# EAGLE design Mixer (EAGLE 9.0.0)
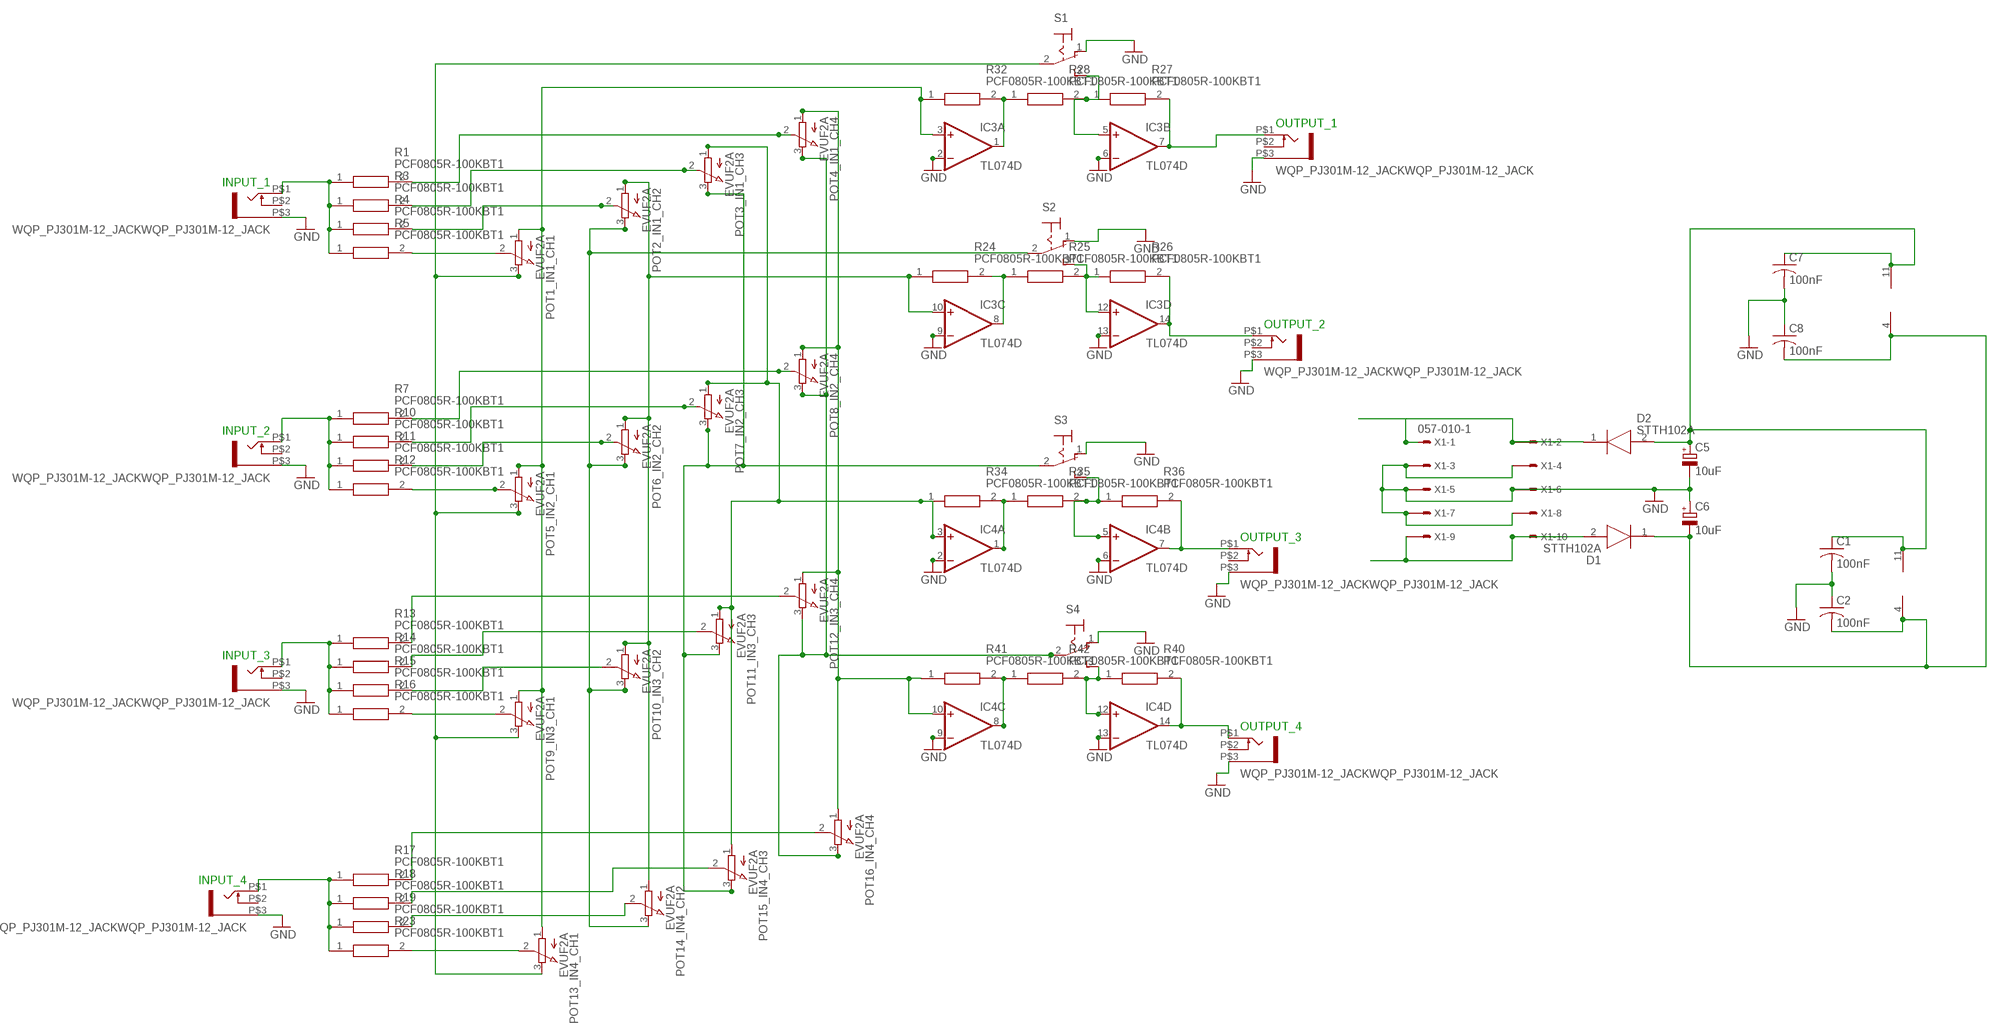
[diagram p0: schematic, sheet 1]

## Parts
C1  100nF  C-USC0805K  [C0805K]
C2  100nF  C-USC0805K  [C0805K]
C5  10uF  CPOL-EU153CLV-0605  [153CLV-0605]
C6  10uF  CPOL-EU153CLV-0605  [153CLV-0605]
C7  100nF  C-USC0805K  [C0805K]
C8  100nF  C-USC0805K  [C0805K]
D1  STTH102A  [DIOM5126X265N]
D2  STTH102A  [DIOM5126X265N]
IC3  TL074D  [SO14]
IC4  TL074D  [SO14]
INPUT_1  WQP_PJ301M-12_JACKWQP_PJ301M-12_JACK  [JACK-3.5]
INPUT_2  WQP_PJ301M-12_JACKWQP_PJ301M-12_JACK  [JACK-3.5]
INPUT_3  WQP_PJ301M-12_JACKWQP_PJ301M-12_JACK  [JACK-3.5]
INPUT_4  WQP_PJ301M-12_JACKWQP_PJ301M-12_JACK  [JACK-3.5]
OUTPUT_1  WQP_PJ301M-12_JACKWQP_PJ301M-12_JACK  [JACK-3.5]
OUTPUT_2  WQP_PJ301M-12_JACKWQP_PJ301M-12_JACK  [JACK-3.5]
OUTPUT_3  WQP_PJ301M-12_JACKWQP_PJ301M-12_JACK  [JACK-3.5]
OUTPUT_4  WQP_PJ301M-12_JACKWQP_PJ301M-12_JACK  [JACK-3.5]
POT1_IN1_CH1  EVUF2A  [EVUF]
POT2_IN1_CH2  EVUF2A  [EVUF]
POT3_IN1_CH3  EVUF2A  [EVUF]
POT4_IN1_CH4  EVUF2A  [EVUF]
POT5_IN2_CH1  EVUF2A  [EVUF]
POT6_IN2_CH2  EVUF2A  [EVUF]
POT7_IN2_CH3  EVUF2A  [EVUF]
POT8_IN2_CH4  EVUF2A  [EVUF]
POT9_IN3_CH1  EVUF2A  [EVUF]
POT10_IN3_CH2  EVUF2A  [EVUF]
POT11_IN3_CH3  EVUF2A  [EVUF]
POT12_IN3_CH4  EVUF2A  [EVUF]
POT13_IN4_CH1  EVUF2A  [EVUF]
POT14_IN4_CH2  EVUF2A  [EVUF]
POT15_IN4_CH3  EVUF2A  [EVUF]
POT16_IN4_CH4  EVUF2A  [EVUF]
R1  PCF0805R-100KBT1  [RESC2012X65N]
R3  PCF0805R-100KBT1  [RESC2012X65N]
R4  PCF0805R-100KBT1  [RESC2012X65N]
R5  PCF0805R-100KBT1  [RESC2012X65N]
R7  PCF0805R-100KBT1  [RESC2012X65N]
R10  PCF0805R-100KBT1  [RESC2012X65N]
R11  PCF0805R-100KBT1  [RESC2012X65N]
R12  PCF0805R-100KBT1  [RESC2012X65N]
R13  PCF0805R-100KBT1  [RESC2012X65N]
R14  PCF0805R-100KBT1  [RESC2012X65N]
R15  PCF0805R-100KBT1  [RESC2012X65N]
R16  PCF0805R-100KBT1  [RESC2012X65N]
R17  PCF0805R-100KBT1  [RESC2012X65N]
R18  PCF0805R-100KBT1  [RESC2012X65N]
R19  PCF0805R-100KBT1  [RESC2012X65N]
R23  PCF0805R-100KBT1  [RESC2012X65N]
R24  PCF0805R-100KBT1  [RESC2012X65N]
R25  PCF0805R-100KBT1  [RESC2012X65N]
R26  PCF0805R-100KBT1  [RESC2012X65N]
R27  PCF0805R-100KBT1  [RESC2012X65N]
R28  PCF0805R-100KBT1  [RESC2012X65N]
R32  PCF0805R-100KBT1  [RESC2012X65N]
R34  PCF0805R-100KBT1  [RESC2012X65N]
R35  PCF0805R-100KBT1  [RESC2012X65N]
R36  PCF0805R-100KBT1  [RESC2012X65N]
R40  PCF0805R-100KBT1  [RESC2012X65N]
R41  PCF0805R-100KBT1  [RESC2012X65N]
R42  PCF0805R-100KBT1  [RESC2012X65N]
S1  M9040P  [M9040P]
S2  M9040P  [M9040P]
S3  M9040P  [M9040P]
S4  M9040P  [M9040P]
X1  057-010-1  [057-010-1]

## Nets
GND: C1.2 C2.1 C5.- C6.+ C7.2 C8.1 IC3.2(A:-IN) IC3.6(B:-IN) IC3.9(C:-IN) IC3.13(D:-IN) IC4.2(A:-IN) IC4.6(B:-IN) IC4.9(C:-IN) IC4.13(D:-IN) INPUT_1.P$3 INPUT_2.P$3 INPUT_3.P$3 INPUT_4.P$3 OUTPUT_1.P$3 OUTPUT_2.P$3 OUTPUT_3.P$3 OUTPUT_4.P$3 S1.1(O) S2.1(O) S3.1(O) S4.1(O) X1.3 X1.4 X1.5 X1.6 X1.7 X1.8
N$1: INPUT_2.P$1 R7.1 R10.1 R11.1 R12.1
N$2: POT13_IN4_CH1.2(S) R23.2
N$3: POT14_IN4_CH2.2(S) R19.2
N$4: POT15_IN4_CH3.2(S) R18.2
N$5: POT16_IN4_CH4.2(S) R17.2
N$6: IC3.1(A:OUT) R28.1 R32.2
N$7: IC3.10(C:+IN) POT2_IN1_CH2.1(A) POT6_IN2_CH2.1(A) POT10_IN3_CH2.1(A) POT14_IN4_CH2.1(A) R24.1
N$8: IC4.14(D:OUT) OUTPUT_4.P$1 R40.2
N$9: POT5_IN2_CH1.2(S) R12.2
N$10: POT6_IN2_CH2.2(S) R11.2
N$11: POT7_IN2_CH3.2(S) R10.2
N$12: POT8_IN2_CH4.2(S) R7.2
N$13: IC3.8(C:OUT) R24.2 R25.1
N$14: IC4.1(A:OUT) R34.2 R35.1
N$15: D1.2(A) X1.9 X1.10
N$16: C1.1 C5.+ C7.1 D2.2(A) IC3.11(P:V-) IC4.11(P:V-)
N$17: POT1_IN1_CH1.2(S) R5.2
N$18: POT2_IN1_CH2.2(S) R4.2
N$19: POT2_IN1_CH2.3(E) POT6_IN2_CH2.3(E) POT10_IN3_CH2.3(E) POT14_IN4_CH2.3(E) S2.2(P)
N$20: IC3.12(D:+IN) R25.2 R26.1 S2.3(S)
N$21: POT1_IN1_CH1.3(E) POT5_IN2_CH1.3(E) POT9_IN3_CH1.3(E) POT13_IN4_CH1.3(E) S1.2(P)
N$22: IC3.3(A:+IN) POT1_IN1_CH1.1(A) POT5_IN2_CH1.1(A) POT9_IN3_CH1.1(A) POT13_IN4_CH1.1(A) R32.1
N$23: IC3.5(B:+IN) R27.1 R28.2 S1.3(S)
N$24: IC3.7(B:OUT) OUTPUT_1.P$1 R27.2
N$25: IC3.14(D:OUT) OUTPUT_2.P$1 R26.2
N$26: D2.1(K) X1.1 X1.2
N$27: IC4.12(D:+IN) R40.1 R42.2 S4.3(S)
N$28: POT3_IN1_CH3.3(E) POT7_IN2_CH3.3(E) POT11_IN3_CH3.3(E) POT15_IN4_CH3.3(E) S3.2(P)
N$29: IC4.3(A:+IN) POT3_IN1_CH3.1(A) POT7_IN2_CH3.1(A) POT11_IN3_CH3.1(A) POT15_IN4_CH3.1(A) R34.1
N$30: IC4.5(B:+IN) R35.2 R36.1 S3.3(S)
N$31: IC4.7(B:OUT) OUTPUT_3.P$1 R36.2
N$32: INPUT_1.P$1 R1.1 R3.1 R4.1 R5.1
N$33: POT3_IN1_CH3.2(S) R3.2
N$34: POT4_IN1_CH4.2(S) R1.2
N$35: C2.2 C6.- C8.2 D1.1(K) IC3.4(P:V+) IC4.4(P:V+)
N$36: POT9_IN3_CH1.2(S) R16.2
N$37: POT10_IN3_CH2.2(S) R15.2
N$38: POT11_IN3_CH3.2(S) R14.2
N$39: POT12_IN3_CH4.2(S) R13.2
N$40: IC4.10(C:+IN) POT4_IN1_CH4.1(A) POT8_IN2_CH4.1(A) POT12_IN3_CH4.1(A) POT16_IN4_CH4.1(A) R41.1
N$41: IC4.8(C:OUT) R41.2 R42.1
N$43: INPUT_3.P$1 R13.1 R14.1 R15.1 R16.1
N$44: INPUT_4.P$1 R17.1 R18.1 R19.1 R23.1
N$45: POT4_IN1_CH4.3(E) POT8_IN2_CH4.3(E) POT12_IN3_CH4.3(E) POT16_IN4_CH4.3(E) S4.2(P)
Unconnected: INPUT_1.P$2 INPUT_2.P$2 INPUT_3.P$2 INPUT_4.P$2 OUTPUT_1.P$2 OUTPUT_2.P$2 OUTPUT_3.P$2 OUTPUT_4.P$2

## Library data of the parts
C1 C2 C7 C8 = resistor:C-US: CAPACITOR, American symbol
C5 C6 = rcl:CPOL-EU: POLARIZED CAPACITOR, European symbol; SPICEPREFIX: C
D1 D2 = STTH102A:STTH102A: HE rectifier diode,STTH102A 1A 200V SMA STMicroelectronics STTH102A, SMT Switching Diode, 200V 1A, 20ns, 2-Pin DO-214AC Source: Datasheet <https://www.arrow.com/en/products/stth102a/stmicroelectronics>; ARROW_PART_NUMBER: STTH102A; DESCRIPTION: HE rectifier diode,STTH102A 1A 200V SMA STMicroelectronics STTH102A, SMT Switching Diode, 200V 1A, 20ns, 2-Pin DO-214AC; HEIGHT: 2.65mm; MANUFACTURER_NAME: STMicroelectronics; MANUFACTURER_PART_NUMBER: STTH102A
IC3 IC4 = linear:TL074: OP AMP
INPUT_1-INPUT_4 OUTPUT_1-OUTPUT_4 = thonkiconn_eagle_v5 (2):WQP_PJ301M-12_JACK: 3.5mm Vertical Jack from Thonk.co.uk
POT1_IN1_CH1 POT2_IN1_CH2 POT3_IN1_CH3 POT4_IN1_CH4 POT5_IN2_CH1 POT6_IN2_CH2 POT7_IN2_CH3 POT8_IN2_CH4 POT9_IN3_CH1 POT10_IN3_CH2 POT11_IN3_CH3 POT12_IN3_CH4 POT13_IN4_CH1 POT14_IN4_CH2 POT15_IN4_CH3 POT16_IN4_CH4 = pot:EVU: 9 mm Square Rotary Potentiometers Source: Panasonic
R1 R3-R5 R7 R10-R19 R23-R28 R32 R34-R36 R40-R42 = PCF0805R-100KBT1:PCF0805R-100KBT1: WELWYN - PCF0805R-100KBT1 - RES, THIN FILM, 100K, 0.1%, 0.1W, 0805 Source: Datasheet <https://componentsearchengine.com/Datasheets/1/PCF0805-13-10KBT1.pdf>; ARROW_PART_NUMBER: PCF0805R-100KBT1; DESCRIPTION: WELWYN - PCF0805R-100KBT1 - RES, THIN FILM, 100K, 0.1%, 0.1W, 0805; HEIGHT: 0.65mm; MANUFACTURER_NAME: WELWYN; MANUFACTURER_PART_NUMBER: PCF0805R-100KBT1
S1-S4 = switch:M9040P: TOGGLE SWITCH Marquardt
X1 = con-panduit:057-010-: CONNECTOR 10-pin series 057 contact pc board low profile headers; OC_FARNELL: unknown; OC_NEWARK: unknown

## Board
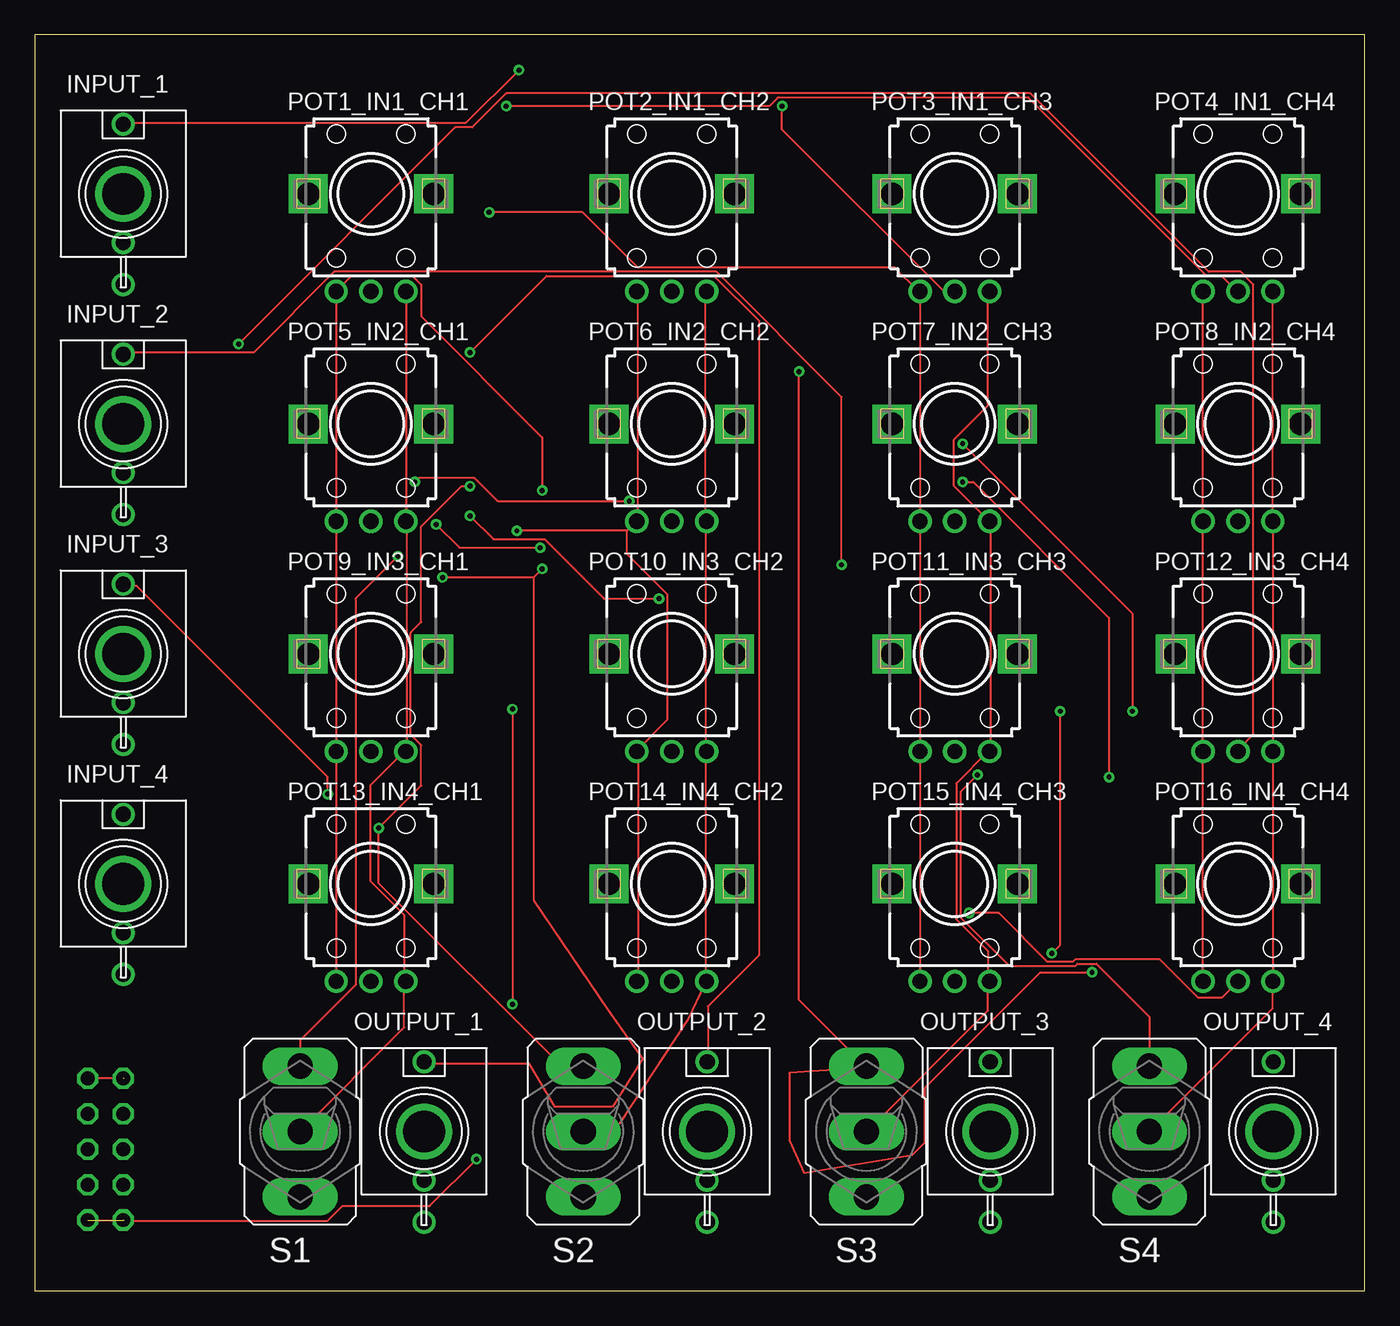
[diagram p1: board, top side]
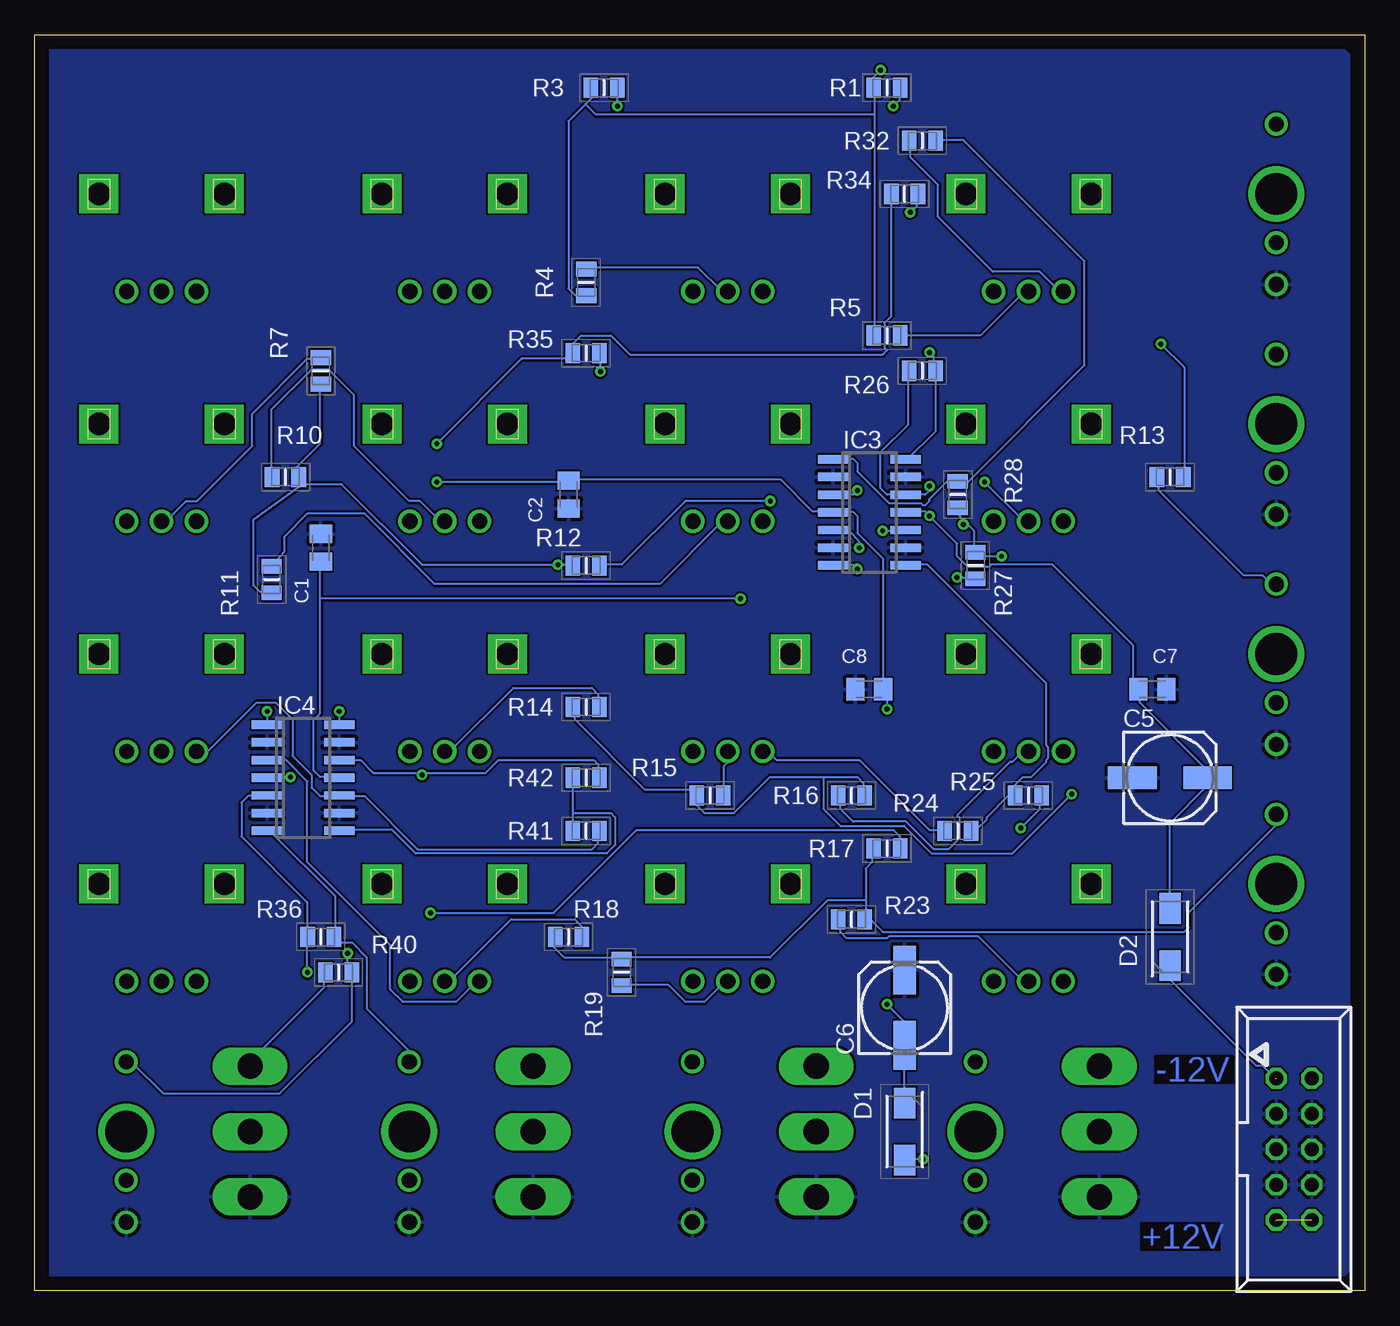
[diagram p2: board, bottom side, seen from below]

Size 95.46 x 90.16 mm. Coordinates in mm from the lower left corner, seen from the top.
Outline: 0,0 95.46,0 95.46,90.16 0,90.16 0,0
Copper layers (1*16): Top 0.035mm / dielectric 1.5mm / Bottom 0.035mm
Design rules "default": minimum track width 6mil, minimum drill 0.35mm, track to track 6mil, track to pad 6mil, pad to pad 6mil, via to via 6mil, smd to smd 6mil, copper to edge 40mil, drill to drill 6mil, minimum pad ring 10mil, minimum via ring 8mil, stop-mask expansion 4mil, vias tented up to drill 0mil, thermal gap 10mil

### Footprints (pad centres in the part's own frame; a part is rotated, then mirrored left to right if it is on the bottom)
C0805K = smd 1.3 x 1.6: 1 -1,0; 2 1,0
153CLV-0605 = smd 3.5 x 1.6: + 2.7,0; - -2.7,0
DIOM5126X265N = smd 2.2 x 1.55: 1 -2.05,0; 2 2.05,0
SO14 = smd 0.6 x 2.2: 1 -3.81,-2.6; 2 -2.54,-2.6; 3 -1.27,-2.6; 4 0,-2.6; 5 1.27,-2.6; 6 2.54,-2.6; 7 3.81,-2.6; 8 3.81,2.6; 9 2.54,2.6; 10 1.27,2.6; 11 0,2.6; 12 -1.27,2.6; 13 -2.54,2.6; 14 -3.81,2.6
JACK-3.5 = drill 1.1: P$1 0,5; P$2 0,-3.5; P$3 0,-6.5 | drill 3: P$4 0,0
EVUF = drill 1.1 pad 1.676: 1 -2.5,-7; 2 0,-7; 3 2.5,-7 | drill 1.6 pad 2.8 square: M1 4.5,0; M2 -4.5,0
RESC2012X65N = smd 1.05 x 1.45: 1 -0.95,0; 2 0.95,0
M9040P = drill 1.803 long: 1 0,4.699; 2 0,0; 3 0,-4.699
057-010-1 = drill 1 octagon: 1 -5.08,-1.27; 2 -5.08,1.27; 3 -2.54,-1.27; 4 -2.54,1.27; 5 0,-1.27; 6 0,1.27; 7 2.54,-1.27; 8 2.54,1.27; 9 5.08,-1.27; 10 5.08,1.27

### Placement (x,y rotation side)
C1  74.93,53.34 90 bottom
C2  57.15,57.15 90 bottom
C5  13.97,36.83 0 bottom
C6  33.02,20.32 90 bottom
C7  15.24,43.18 0 bottom
C8  35.56,43.18 0 bottom
D1  33.02,11.43 270 bottom
D2  13.97,25.4 90 bottom
IC3  35.56,55.88 270 bottom
IC4  76.2,36.83 270 bottom
INPUT_1  6.35,78.74 0 top
INPUT_2  6.35,62.23 0 top
INPUT_3  6.35,45.72 0 top
INPUT_4  6.35,29.21 0 top
OUTPUT_1  27.94,11.43 0 top
OUTPUT_2  48.26,11.43 0 top
OUTPUT_3  68.58,11.43 0 top
OUTPUT_4  88.9,11.43 0 top
POT1_IN1_CH1  24.13,78.74 0 top
POT2_IN1_CH2  45.72,78.74 0 top
POT3_IN1_CH3  66.04,78.74 0 top
POT4_IN1_CH4  86.36,78.74 0 top
POT5_IN2_CH1  24.13,62.23 0 top
POT6_IN2_CH2  45.72,62.23 0 top
POT7_IN2_CH3  66.04,62.23 0 top
POT8_IN2_CH4  86.36,62.23 0 top
POT9_IN3_CH1  24.13,45.72 0 top
POT10_IN3_CH2  45.72,45.72 0 top
POT11_IN3_CH3  66.04,45.72 0 top
POT12_IN3_CH4  86.36,45.72 0 top
POT13_IN4_CH1  24.13,29.21 0 top
POT14_IN4_CH2  45.72,29.21 0 top
POT15_IN4_CH3  66.04,29.21 0 top
POT16_IN4_CH4  86.36,29.21 0 top
R1  34.29,86.36 0 bottom
R3  54.61,86.36 0 bottom
R4  55.88,72.39 90 bottom
R5  34.29,68.58 0 bottom
R7  74.93,66.04 90 bottom
R10  77.47,58.42 180 bottom
R11  78.47,51.07 90 bottom
R12  55.88,52.07 0 bottom
R13  13.97,58.42 0 bottom
R14  55.88,41.91 0 bottom
R15  46.99,35.56 0 bottom
R16  36.83,35.56 180 bottom
R17  34.29,31.75 0 bottom
R18  57.15,25.4 0 bottom
R19  53.34,22.86 270 bottom
R23  36.83,26.67 180 bottom
R24  29.21,33.02 0 bottom
R25  24.13,35.56 0 bottom
R26  31.75,66.04 0 bottom
R27  27.94,52.07 270 bottom
R28  29.21,57.15 270 bottom
R32  31.75,82.55 0 bottom
R34  33.02,78.74 180 bottom
R35  55.88,67.31 0 bottom
R36  74.93,25.4 0 bottom
R40  73.66,22.86 0 bottom
R41  55.88,33.02 180 bottom
R42  55.88,36.83 0 bottom
S1  19.05,11.43 180 top
S2  39.37,11.43 180 top
S3  59.69,11.43 180 top
S4  80.01,11.43 180 top
X1  5.08,10.16 270 bottom

### Tracks (layer width: path | path; a pad name or v marks a point on that pad's centre or on a via)
+12V  (via drill 0.35)
  Top 0.152: v6.25,5.03 v3.81,5.03
GND
  pour Bottom: 0,87.63 2.54,90.17 93.98,90.17 96.52,87.63 96.52,2.54 93.98,0 2.54,0 0,2.54
N$1  (via drill 0.35)
  Top 0.152: v57.91,52.12 57.91,64.16 48.92,73.15 21.49,73.15 15.7,67.36 6.4,67.36 INPUT_2.P$1
  Bottom 0.152: 76.05,57.91 73.46,57.91 67.67,52.12 v57.91,52.12 56.84,52.12 R12.1 | 76.05,57.91 76.5,58.37 R10.1 | R7.1 74.98,65.08 74.98,60.81 76.66,59.13 76.66,58.52 R10.1 | 76.05,57.91 76.2,57.91 79.79,55.32 79.79,50.66 79.33,50.21 78.57,50.21 R11.1 | 76.05,57.91 R10.1
N$2
  Bottom 0.152: R23.2 37.64,26.67 37.64,25.76 37.19,25.3 34.29,25.3 34.14,25.45 27.74,25.45 24.54,22.25 24.23,22.25 POT13_IN4_CH1.2
N$3
  Bottom 0.152: R19.2 53.34,21.95 49.99,21.95 48.77,20.73 47.4,20.73 46.02,22.1 45.72,22.1 POT14_IN4_CH2.2
N$4
  Bottom 0.152: R18.2 56.24,25.45 56.24,26.21 56.69,26.67 61.27,26.67 65.68,22.25 65.99,22.25 POT15_IN4_CH3.2
N$5  (via drill 0.35)
  Top 0.152: v67.06,27.13 69.19,27.13 72.69,23.62 74.52,23.62 74.68,23.77 80.77,23.77 83.52,21.03 85.19,21.03 86.26,22.1 POT16_IN4_CH4.2
  Bottom 0.152: v67.06,27.13 58.22,27.13 52.27,33.07 33.83,33.07 33.38,32.61 33.38,31.85 R17.2
N$6
  Bottom 0.152: IC3.1 38.1,59.74 36.73,59.74 36.42,59.44 36.42,58.83 34.14,56.54 31.85,56.54 31.7,56.39 31.55,56.39 31.24,56.69 31.24,56.84 30.02,58.06 29.26,58.06 R28.1 29.11,58.06 28.5,58.06 20.12,66.45 20.12,73.91 28.8,82.6 30.79,82.6 R32.2
N$7  (via drill 0.35)
  Top 0.152: 42.52,54.56 v34.59,54.56 | 42.52,54.56 43.13,55.17 POT6_IN2_CH2.1 43.28,55.32 43.28,71.63 POT2_IN1_CH2.1 | POT14_IN4_CH2.1 43.28,22.25 43.28,38.71 POT10_IN3_CH2.1 43.28,38.86 45.41,41 45.41,49.99 42.52,52.88 42.52,54.56
  Bottom 0.152: v34.59,54.56 33.07,54.56 IC3.10 | R24.1 30.18,33.07 31.24,33.07 36.27,38.1 42.22,38.1 42.82,38.71 43.13,38.71 POT10_IN3_CH2.1
N$8  (via drill 0.35)
  Top 0.152: v73.61,41.6 73.61,24.84 v73,24.23
  Bottom 0.152: OUTPUT_4.P$1 88.85,16.31 88.39,16.31 86.26,14.17 77.88,14.17 72.69,19.36 72.69,22.86 R40.2 72.85,22.86 73,23.01 v73,24.23 | v73.61,41.6 73.61,40.69 IC4.14
N$9  (via drill 0.35)
  Top 0.152: v42.67,56.69 33.22,56.69 31.55,58.37 27.58,58.37 v27.28,58.06
  Bottom 0.152: v42.67,56.69 48.77,56.69 53.34,52.12 54.86,52.12 R12.2 | v27.28,58.06 24.54,55.32 24.23,55.32 POT5_IN2_CH1.2
N$10
  Bottom 0.152: R11.2 77.57,53.03 77.57,54.1 75.89,55.78 71.78,55.78 66.75,50.75 50.6,50.75 46.18,55.17 45.72,55.17 POT6_IN2_CH2.2
N$11
  Bottom 0.152: R10.2 78.49,58.52 78.49,63.25 75.59,66.14 74.37,66.14 72.54,64.31 72.54,60.66 68.58,56.69 67.82,56.69 66.45,55.32 66.14,55.32 POT7_IN2_CH3.2
N$12
  Bottom 0.152: R7.2 74.98,66.9 75.89,66.9 79.86,62.94 79.86,60.66 83.82,56.69 84.58,56.69 85.95,55.32 86.26,55.32 POT8_IN2_CH4.2
N$13
  Bottom 0.152: R24.2 28.19,33.07 27.89,33.07 27.13,33.83 27.13,33.98 25.6,35.51 25.15,35.51 R25.1 25.15,35.66 25.15,36.27 24.54,36.88 23.93,36.88 22.86,37.95 22.86,38.1 22.71,38.25 22.71,39.01 22.86,39.17 22.86,43.59 31.39,52.12 32.92,52.12 IC3.8
N$14  (via drill 0.35)
  Top 0.152: v78.79,41.6 78.79,48.62 v66.6,60.81
  Bottom 0.152: R34.2 33.98,78.64 33.98,69.95 34.44,69.49 34.44,67.67 34.29,67.51 34.59,67.21 52.73,67.21 54.1,68.58 56.24,68.58 56.84,67.97 56.84,67.36 R35.1 56.84,67.21 57.15,66.9 60.5,66.9 v66.6,60.81 | v78.79,41.6 78.79,40.69 IC4.1
N$15  (via drill 0.35)  (2 unrouted)
  Top 0.152: v31.7,9.45 28.35,6.1 22.1,6.1 21.03,5.03 6.4,5.03
  Bottom 0.152: v31.7,9.45 32.92,9.45 D1.2
N$16  (via drill 0.35)
  Top 0.152: v44.81,49.68 40.84,49.68 36.58,53.95 32.92,53.95 v31.24,55.63
  Bottom 0.152: 74.98,49.68 74.98,41.45 75.44,41 75.44,37.34 74.98,36.88 73.61,36.88 IC4.11 | 74.98,49.68 74.98,52.27 C1.1 | D2.2 14.02,27.58 14.02,33.53 11.28,36.27 11.28,36.73 C5.+ 11.28,36.88 11.28,37.34 16.15,42.22 16.15,43.13 C7.1 16.31,43.28 16.61,43.59 16.61,46.33 22.4,52.12 26.82,52.12 26.98,51.97 28.5,51.97 29.26,52.73 29.26,53.65 v31.24,55.63 31.55,55.93 32.92,55.93 IC3.11 | v44.81,49.68 74.98,49.68
N$17
  Bottom 0.152: R5.2 27.58,68.58 24.54,71.63 24.23,71.63 POT1_IN1_CH1.2
N$18
  Bottom 0.152: R4.2 55.78,73.46 47.85,73.46 46.18,71.78 45.72,71.78 POT2_IN1_CH2.2
N$19
  Top 0.152: S2.2 40.74,11.43 42.01,12.04 46.89,19.46 48.16,22.1 POT14_IN4_CH2.3 48.16,22.25 48.16,38.71 POT10_IN3_CH2.3 48.16,38.86 48.16,55.17 POT6_IN2_CH2.3 48.16,55.32 48.16,71.63 POT2_IN1_CH2.3
N$20  (via drill 0.35)
  Top 0.152: S2.3 39.32,16.15 37.8,16.15 24.69,29.26 v24.69,33.22 27.74,36.27 27.74,39.17 26.98,39.93 26.98,47.24 27.74,48.01 27.74,54.86 30.63,57.76 v31.24,57.76
  Bottom 0.152: R26.1 32.77,65.99 32.77,62.18 34.75,60.2 34.75,57.61 34.29,57.15 IC3.12 31.55,57.15 31.24,57.45 v31.24,57.76 | v24.69,33.22 23.32,34.59 23.32,35.51 R25.2
N$21
  Top 0.152: S1.2 26.52,18.9 26.52,22.1 POT13_IN4_CH1.3 26.52,22.25 26.52,26.98 24.08,29.41 24.08,36.27 26.52,38.71 POT9_IN3_CH1.3 26.67,38.86 26.67,55.17 POT5_IN2_CH1.3 26.67,55.32 26.67,71.63 POT1_IN1_CH1.3
N$22  (via drill 0.35)
  Top 0.152: POT13_IN4_CH1.1 21.64,22.25 POT9_IN3_CH1.1 21.64,38.86 21.64,55.17 POT5_IN2_CH1.1 21.64,55.32 21.64,71.63 POT1_IN1_CH1.1 21.64,71.78 22.71,72.85 27.13,72.85 27.74,72.24 27.74,69.95 36.42,61.27 v36.42,57.45
  Bottom 0.152: R32.1 32.61,82.45 32.61,81.38 30.63,79.4 30.63,77.11 26.67,73.15 23.32,73.15 21.95,71.78 21.64,71.78 POT1_IN1_CH1.1 | IC3.3 36.73,57.15 v36.42,57.45
N$23  (via drill 0.35)
  Top 0.152: v36.27,53.34 30.48,53.34 v28.8,55.02 | S1.3 19.05,17.98 23.01,21.95 23.01,49.68 v26.06,52.73
  Bottom 0.152: 28.65,55.17 29.11,55.63 29.11,56.08 R28.2 | 28.65,55.17 28.04,54.56 28.04,53.03 R27.1 27.89,52.88 27.74,52.73 v26.06,52.73 | v36.27,53.34 36.27,53.8 37.03,54.56 38.1,54.56 IC3.5 | 28.65,55.17 v28.8,55.02
N$24  (via drill 0.35)
  Top 0.152: 35.81,51.21 v29.26,51.21 | v36.42,51.82 35.81,51.21 | 35.81,51.21 35.81,28.04 41.1,20.22 43.64,16.66 41.45,13.21 37.34,13.21 35.51,16.31 28.04,16.31 OUTPUT_1.P$1
  Bottom 0.152: v29.26,51.21 28.04,51.21 R27.2 | v36.42,51.82 36.73,52.12 38.1,52.12 IC3.7
N$25  (via drill 0.35)
  Top 0.152: v31.24,67.36 36.73,72.85 48.77,72.85 51.97,69.65 51.97,24.08 48.31,20.42 48.31,16.46 OUTPUT_2.P$1
  Bottom 0.152: IC3.14 32.92,59.59 30.79,61.72 30.79,65.99 R26.2 30.94,66.14 30.94,67.06 v31.24,67.36
N$26  (via drill 0.35)  (1 unrouted)
  Top 0.152: v6.4,15.24 X1.2
  Bottom 0.152: v6.4,15.24 7.32,16.15 7.77,16.15 13.87,22.25 13.87,23.32 D2.1
N$27  (via drill 0.35)
  Top 0.152: S4.3 80.01,19.66 76.2,23.47 74.83,23.47 74.68,23.32 69.95,23.32 66.45,26.82 66.45,35.81 v67.67,37.03
  Bottom 0.152: S4.3 80.01,16.46 74.68,21.79 74.68,22.86 R40.1 | 67.67,37.19 71.17,37.19 72.08,38.1 IC4.12 | 67.67,37.19 63.09,37.19 62.18,38.1 55.32,38.1 55.02,37.8 55.02,36.88 R42.2 | 67.67,37.19 v67.67,37.03
N$28
  Top 0.152: S3.2 59.74,11.43 68.43,20.12 68.43,22.1 POT15_IN4_CH3.3 68.43,22.25 68.43,24.38 66.14,26.67 66.14,36.42 68.43,38.71 POT11_IN3_CH3.3 68.58,38.86 68.58,55.17 POT7_IN2_CH3.3 68.43,55.32 65.99,57.76 65.99,61.11 68.43,63.55 68.43,71.63 POT3_IN1_CH3.3
N$29  (via drill 0.35)
  Top 0.152: v32.61,77.42 39.32,77.42 43.28,73.46 61.72,73.46 63.4,71.78 POT3_IN1_CH3.1 63.55,71.63 63.55,55.32 POT7_IN2_CH3.1 63.55,55.17 63.55,38.86 POT11_IN3_CH3.1 63.55,38.71 63.55,22.25 POT15_IN4_CH3.1
  Bottom 0.152: IC4.3 77.42,38.1 75.89,36.58 75.89,30.79 69.95,24.84 69.95,21.64 69.04,20.73 65.23,20.73 63.86,22.1 63.55,22.1 POT15_IN4_CH3.1 | v32.61,77.42 32.16,77.88 32.16,78.64 R34.1
N$30  (via drill 0.35)
  Top 0.152: v54.86,65.99 54.86,20.88 59.59,16.15 S3.3 59.59,16 54.15,15.65 54.15,10.82 55.22,8.48 62.99,9.75 63.91,10.67 63.91,14.58 72.19,22.86 v75.89,22.86
  Bottom 0.152: IC4.5 78.94,35.51 80.16,35.51 80.62,35.05 80.62,32.61 75.89,27.89 75.89,25.45 R36.1 75.89,25.3 v75.89,22.86 | v54.86,65.99 54.86,67.21 R35.2
N$31
  Bottom 0.152: IC4.7 78.79,32.92 78.49,32.92 73.91,28.35 73.91,25.45 R36.2 73.91,25.3 73.61,24.99 72.69,24.99 71.63,23.93 71.63,20.27 68.58,17.22 OUTPUT_3.P$1
N$32  (via drill 0.35)
  Top 0.152: v34.75,87.63 30.94,83.82 6.4,83.82 INPUT_1.P$1
  Bottom 0.152: 55.93,85.19 55.47,85.65 55.47,86.26 R3.1 | 55.93,85.19 57.15,83.97 57.15,71.93 56.69,71.48 55.93,71.48 R4.1 | 35.2,84.43 35.2,86.26 R1.1 35.36,86.41 35.36,87.02 v34.75,87.63 | 35.2,84.43 35.2,68.58 R5.1 | 55.93,85.19 55.17,84.43 35.2,84.43
N$33  (via drill 0.35)
  Top 0.152: v53.65,85.04 53.65,83.36 65.23,71.78 65.99,71.78 POT3_IN1_CH3.2
  Bottom 0.152: v53.65,85.04 53.65,86.26 R3.2
N$34  (via drill 0.35)
  Top 0.152: v33.83,85.04 52.73,85.04 53.34,85.65 71.32,85.65 84.12,72.85 85.19,72.85 86.26,71.78 POT4_IN1_CH4.2
  Bottom 0.152: v33.83,85.04 33.38,85.5 33.38,86.26 R1.2
N$35  (via drill 0.35)
  Top 0.152: v77.11,36.88 77.11,48.31 67.36,58.06 v66.6,58.06 | v34.29,41.76 v34.29,20.57
  Bottom 0.152: D1.1 33.07,13.56 33.07,17.53 C6.- 33.07,17.68 33.07,19.36 v34.29,20.57 | v77.11,36.88 78.79,36.88 IC4.4 | v66.6,58.06 57.15,58.06 C2.2 57.15,58.22 41.91,58.22 39.62,55.93 38.25,55.93 IC3.4 38.1,55.93 36.73,55.93 36.42,55.63 36.42,54.41 34.59,52.58 34.59,43.28 C8.2 34.44,43.13 34.29,42.98 v34.29,41.76
N$36
  Bottom 0.152: R16.2 37.64,35.51 37.64,34.59 36.73,33.68 32.92,33.68 30.94,31.7 29.87,31.7 29.11,32.46 29.11,33.98 29.26,34.14 25.45,37.95 25.3,37.95 24.54,38.71 24.23,38.71 POT9_IN3_CH1.2
N$37
  Bottom 0.152: POT10_IN3_CH2.2 45.72,37.95 46.02,37.64 46.02,35.66 R15.2
N$38
  Bottom 0.152: R14.2 55.02,41.91 55.02,42.82 55.47,43.28 61.11,43.28 65.53,38.86 65.99,38.86 POT11_IN3_CH3.2
N$39  (via drill 0.35)
  Top 0.152: v14.63,67.97 30.18,83.52 31.39,83.52 33.83,85.95 71.48,85.95 84.28,73.15 86.56,73.15 87.48,72.24 87.48,39.93 86.41,38.86 POT12_IN3_CH4.2
  Bottom 0.152: v14.63,67.97 12.95,66.29 12.95,58.52 R13.2
N$40
  Top 0.152: POT16_IN4_CH4.1 83.82,22.25 83.82,38.71 POT12_IN3_CH4.1 83.82,38.86 83.82,55.17 POT8_IN2_CH4.1 83.82,55.32 83.82,71.63 POT4_IN1_CH4.1
  Bottom 0.152: R41.1 55.02,32.92 55.02,32.16 55.47,31.7 67.97,31.7 71.78,35.51 73.46,35.51 IC4.10 73.61,35.51 74.98,35.51 75.59,36.12 75.59,37.03 76.96,38.41 76.96,41 78.18,42.22 79.55,42.22 83.06,38.71 83.82,38.71 POT12_IN3_CH4.1
N$41
  Bottom 0.152: 56.84,34.29 56.84,36.73 R42.1 | 56.84,34.29 56.84,33.07 R41.2 | 56.84,34.29 54.1,34.29 53.8,33.98 53.8,32 54.41,31.39 68.12,31.39 69.8,33.07 73.46,33.07 IC4.8
N$43  (via drill 0.35)
  Top 0.152: v21.03,35.66 21.03,36.88 7.32,50.6 6.4,50.6 INPUT_3.P$1
  Bottom 0.152: R13.1 14.78,58.37 14.78,57.45 8.69,51.36 7.32,51.36 6.71,50.75 6.4,50.75 INPUT_3.P$1 | 38.86,36.88 42.67,36.88 45.26,34.29 47.4,34.29 48.01,34.9 48.01,35.51 R15.1 48.01,35.66 48.31,35.97 51.66,35.97 56.69,41 56.69,41.91 R14.1 | 38.86,36.88 36.42,36.88 35.97,36.42 35.97,35.66 R16.1 | v21.03,35.66 25.3,31.39 31.09,31.39 33.07,33.38 37.64,33.38 38.86,34.59 38.86,36.88
N$44
  Bottom 0.152: 53.34,23.93 57.45,23.93 58.22,24.69 58.22,25.3 R18.1 | 35.81,28.04 35.81,30.33 35.36,30.79 35.36,31.7 R17.1 | 35.81,28.04 35.81,26.98 | 35.81,26.98 35.81,26.67 R23.1 35.81,26.98 | 35.81,26.98 34.59,25.76 12.95,25.76 12.65,26.06 12.65,27.13 6.4,33.38 6.4,34.14 INPUT_4.P$1 | 53.34,23.93 42.67,23.93 38.56,28.04 35.81,28.04 | 53.34,23.93 R19.1
N$45
  Top 0.152: S4.2 88.85,20.27 88.85,22.1 POT16_IN4_CH4.3 88.85,22.25 POT12_IN3_CH4.3 88.85,38.86 88.85,55.17 POT8_IN2_CH4.3 88.85,55.32 88.85,71.63 POT4_IN1_CH4.3

### Text on the board
Bottom: -12V | +12V